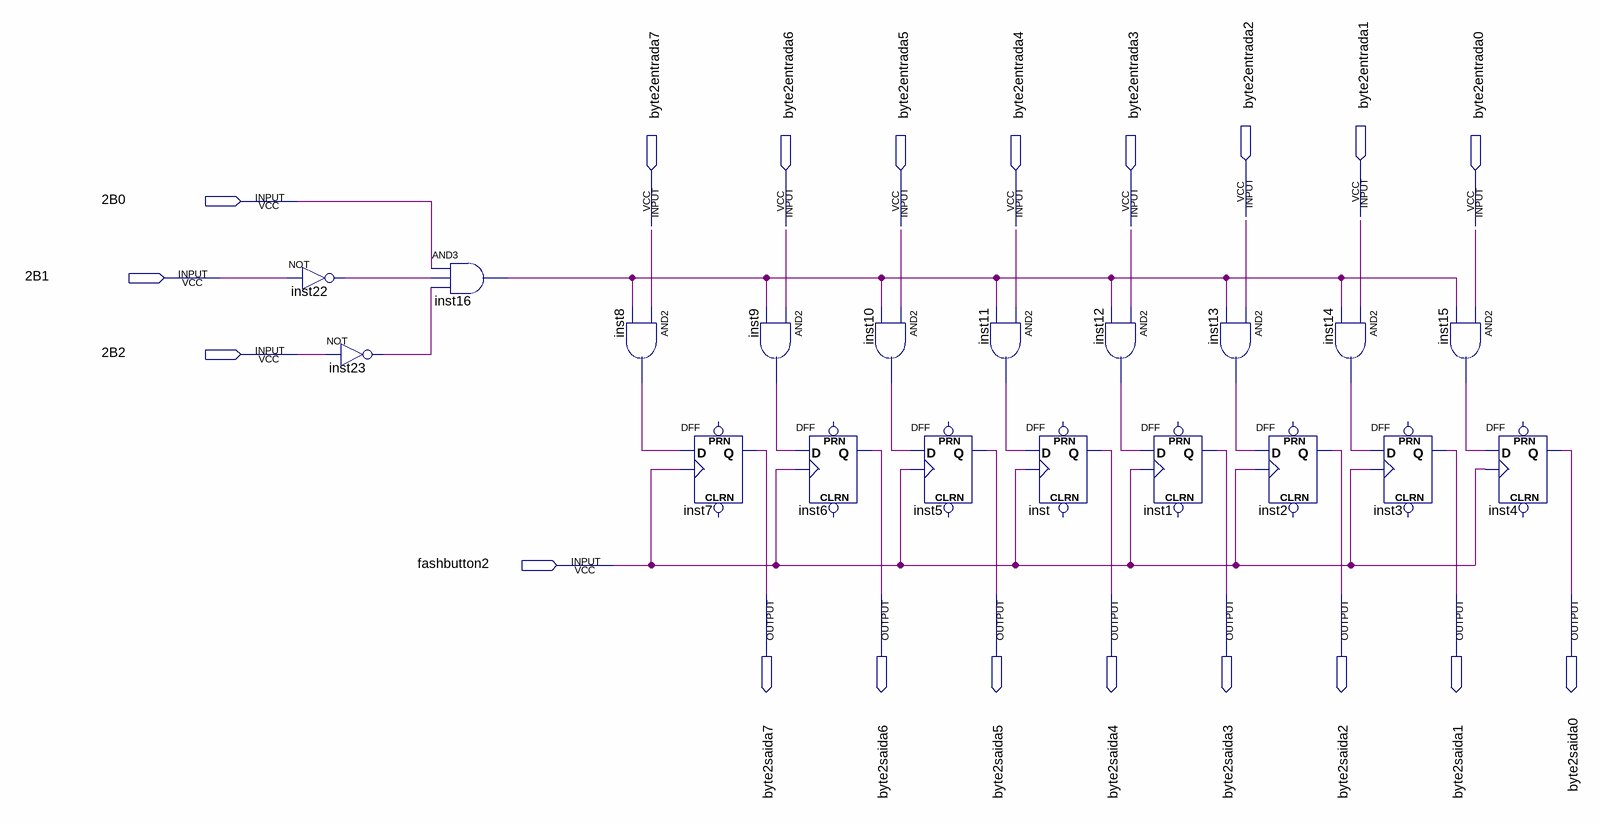
[diagram p0: schematic sheet]
// Quartus schematic segundobyte.bdf as structural Verilog: 19 symbols, 20 pins
module segundobyte (
  input  \2B0 ,
  input  byte2entrada2,
  input  byte2entrada1,
  input  byte2entrada7,
  input  byte2entrada6,
  input  byte2entrada5,
  input  byte2entrada4,
  input  byte2entrada3,
  input  byte2entrada0,
  input  \2B1 ,
  input  \2B2 ,
  input  fashbutton2,
  output byte2saida7,
  output byte2saida6,
  output byte2saida5,
  output byte2saida4,
  output byte2saida3,
  output byte2saida2,
  output byte2saida1,
  output byte2saida0
);

  wire inst8_out, inst9_out, inst10_out, inst11_out, inst12_out, inst13_out, inst14_out, inst15_out,
       inst16_out, inst22_out, inst23_out;

  not inst22 (inst22_out, \2B1 );
  not inst23 (inst23_out, \2B2 );
  and inst16 (inst16_out, \2B0 , inst22_out, inst23_out);
  and inst8 (inst8_out, byte2entrada7, inst16_out);
  DFF inst7 (.CLK(fashbutton2), .D(inst8_out), .Q(byte2saida7));  // open: CLRN, PRN
  and inst9 (inst9_out, byte2entrada6, inst16_out);
  DFF inst6 (.CLK(fashbutton2), .D(inst9_out), .Q(byte2saida6));  // open: CLRN, PRN
  and inst10 (inst10_out, byte2entrada5, inst16_out);
  DFF inst5 (.CLK(fashbutton2), .D(inst10_out), .Q(byte2saida5));  // open: CLRN, PRN
  and inst11 (inst11_out, byte2entrada4, inst16_out);
  DFF inst (.CLK(fashbutton2), .D(inst11_out), .Q(byte2saida4));  // open: CLRN, PRN
  and inst12 (inst12_out, byte2entrada3, inst16_out);
  DFF inst1 (.CLK(fashbutton2), .D(inst12_out), .Q(byte2saida3));  // open: CLRN, PRN
  and inst13 (inst13_out, byte2entrada2, inst16_out);
  DFF inst2 (.CLK(fashbutton2), .D(inst13_out), .Q(byte2saida2));  // open: CLRN, PRN
  and inst14 (inst14_out, byte2entrada1, inst16_out);
  DFF inst3 (.CLK(fashbutton2), .D(inst14_out), .Q(byte2saida1));  // open: CLRN, PRN
  and inst15 (inst15_out, byte2entrada0, inst16_out);
  DFF inst4 (.CLK(fashbutton2), .D(inst15_out), .Q(byte2saida0));  // open: CLRN, PRN
endmodule
